# Altium project MB1115.PrjPCB
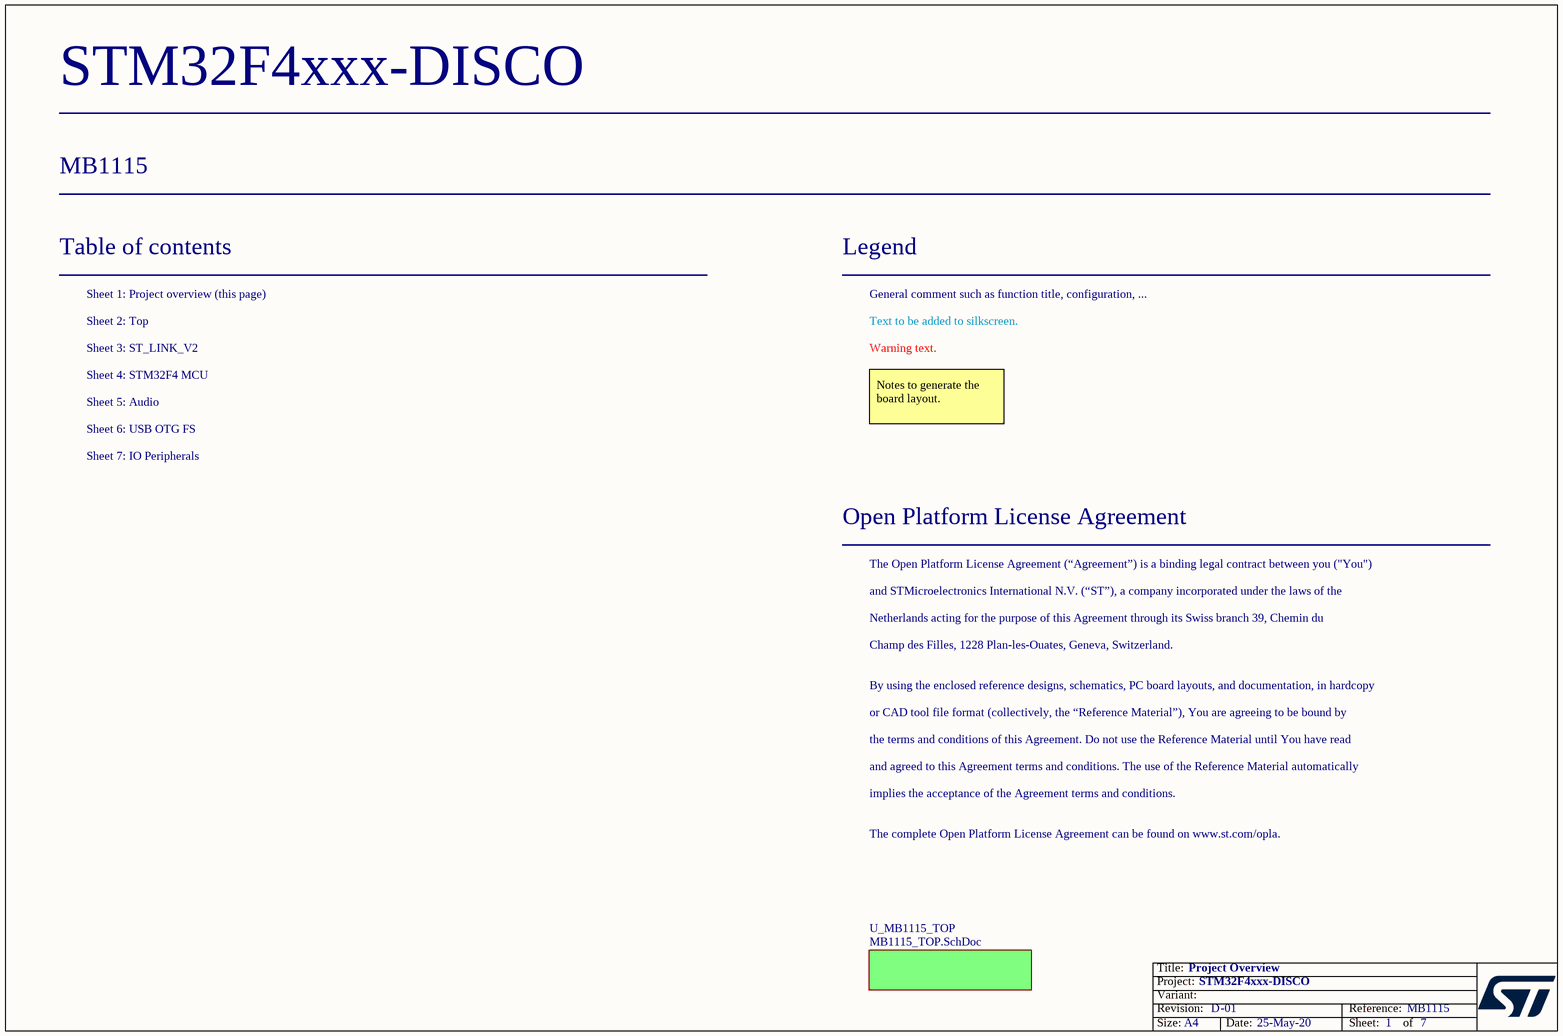
[diagram p0: Project_Overview.SchDoc]
Board_Reference: MB1115; Board_PCB_Revision: D; Board_Name: STM32F4xxx-DISCO; Board_Document_Date: 25-May-20; Board_Assembly_Revision: 01
6 sheets, 156 parts. Net scope: flat (ports and power ports of the same name join across sheets).
Board file: MB1115D.PcbDoc
Sheets:
  Project_Overview.SchDoc
    U_MB1115_TOP = MB1115_TOP.SchDoc
      U_ST_LINK = ST_LINK_V2.SCHDOC
      U_Audio = Audio.SchDoc
      U_IO Peripherals = IO Peripherals.SchDoc
      U_USB_OTG_FS = USB_OTG_FS.SchDoc

## Sheet Project_Overview.SchDoc: Project Overview
size A4; Date: Not used; ApprovedBy: Not used; CheckedBy: Not used; Author: Not used; CompanyName: STMicroelectronics; DrawnBy: Not used; Engineer: Not used; Organization: Not used; Address1: Not used; Address2: Not used; Address3: Not used; Address4: Not used; DocumentNumber: Not used; Revision: Not used; SheetNumber: 1; SheetTotal: 7; CurrentTime: Not used; CurrentDate: Not used; Time: Not used; DocumentFullPathAndName: Not used; DocumentName: Not used; ModifiedDate: Not used; ImagePath: Not used; ProjectName: Not used; Application_BuildNumber: Not used

### Sub-sheets
U_MB1115_TOP = MB1115_TOP.SchDoc: no entries

### Notes on the sheet
- Table of contents
- Sheet 1: Project overview (this page)
- Legend
- General comment such as function title, configuration, ...
- Sheet 2: Top
- Sheet 3: ST_LINK_V2
- Sheet 4: STM32F4 MCU
- Text to be added to silkscreen.
- Warning text.
- Sheet 6: USB OTG FS
- Sheet 5: Audio
- Notes to generate the board layout.
- Sheet 7: IO Peripherals
- Open Platform License Agreement
- The Open Platform License Agreement (“Agreement”) is a binding legal contract between you ("You")
- and STMicroelectronics International N.V. (“ST”), a company incorporated under the laws of the
- Netherlands acting for the purpose of this Agreement through its Swiss branch 39, Chemin du
- Champ des Filles, 1228 Plan-les-Ouates, Geneva, Switzerland.
- By using the enclosed reference designs, schematics, PC board layouts, and documentation, in hardcopy
- or CAD tool file format (collectively, the “Reference Material”), You are agreeing to be bound by
- the terms and conditions of this Agreement. Do not use the Reference Material until You have read
- and agreed to this Agreement terms and conditions. The use of the Reference Material automatically
- implies the acceptance of the Agreement terms and conditions.
- The complete Open Platform License Agreement can be found on www.st.com/opla.
- Title:
- Project:
- Size:
- Revision:
- Variant:
- A4
- -
- Date:
- Reference:
- Sheet:
- of

## Sheet MB1115_TOP.SchDoc: TOP
size A4; DocumentNumber: 1; SheetNumber: 2; SheetTotal: 7; PageSetup: Record=PageOptions|CenterHorizontal=True|CenterVertical=True|PrintScale=1.00|XCorrection=1.00|YCorrection=1.00|PrintKind=1|BorderSize=5000000|LeftOffset=0|BottomOffset=0|Orientation=2|PaperLength=1000|PaperWidth=1000|Scale=100|PaperSource=15|PrintQuality=1200|MediaType=1|DitherType=10|PaperKind=A4|PrintScaleMode=1
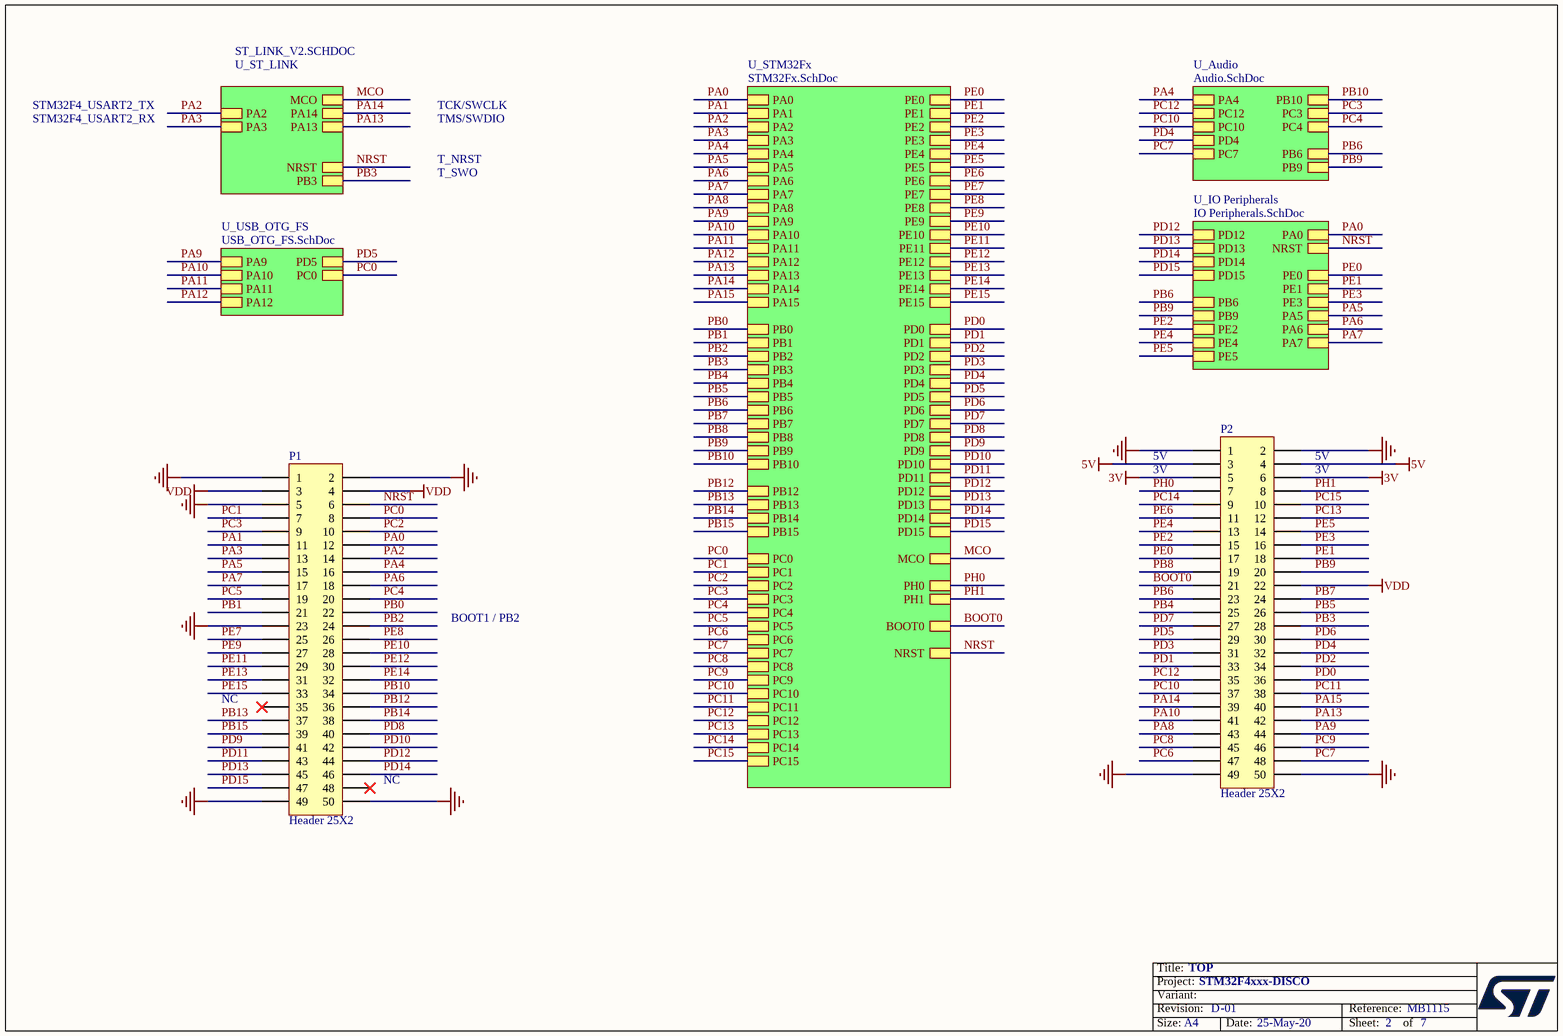
[diagram p1: MB1115_TOP.SchDoc]

### Parts
P1  Header 25X2  [HDR2X25 (Primary)]
P2  Header 25X2  [HDR2X25 (Primary)]

### Sub-sheets
U_Audio = Audio.SchDoc: PA4, PC12, PC10, PD4, PC7, PC3, PB10, PC4, PB6, PB9
U_IO Peripherals = IO Peripherals.SchDoc: PA0, NRST, PE0, PE1, PE3, PA5, PA7, PA6, PE4, PE5, PE2, PB6, PB9, PD12, PD13, PD14, PD15
U_ST_LINK = ST_LINK_V2.SCHDOC: PA13, PA14, NRST, PB3, MCO, PA3, PA2
U_STM32Fx = STM32Fx.SchDoc (file not in this document): PD2, BOOT0, PH1, PH0, NRST, PE0, PE1, PE2, PE3, PE4, PE5, PE6, PE7, PE8, PE9, PE10, PE11, PE12, PE13, PE14, PE15, PD0, PD1, PD3, PD4, PD5, PD6, PD7, PD8, PD9, PD10, PD11, PD12, PD13, PD14, PD15, MCO, PA1, PA2, PA3, PA4, PA5, PA6, PA7, PA8, PA9, PA10, PA11, PA12, PA13, PA14, PA15, PB1, PB2, PB3, PB4, PB5, PB6, PB7, PB8, PB9, PB10, PB12, PB13, PB14, PB15, PC1, PC2, PC3, PC4, PC5, PC6, PC7, PC8, PC9, PC10, PC11, PC12, PC13, PA0, PB0, PC0, PC14, PC15
U_USB_OTG_FS = USB_OTG_FS.SchDoc: PC0, PD5, PA9, PA10, PA11, PA12

### Nets
3V: P2.5 P2.6
5V: P2.3 P2.4
GND: P1.1 P1.2 P1.5 P1.23 P1.49 P1.50 P2.1 P2.2 P2.49 P2.50
VDD: P1.3 P1.4 P2.22
BOOT0: P2.21 ; sheet U_STM32Fx/BOOT0
MCO: sheet U_ST_LINK/MCO, sheet U_STM32Fx/MCO
NRST: P1.6 ; sheet U_ST_LINK/NRST, sheet U_IO Peripherals/NRST, sheet U_STM32Fx/NRST
PA0: P1.12 ; sheet U_IO Peripherals/PA0, sheet U_STM32Fx/PA0
PA1: P1.11 ; sheet U_STM32Fx/PA1
PA2: P1.14 ; sheet U_ST_LINK/PA2, sheet U_STM32Fx/PA2
PA3: P1.13 ; sheet U_ST_LINK/PA3, sheet U_STM32Fx/PA3
PA4: P1.16 ; sheet U_Audio/PA4, sheet U_STM32Fx/PA4
PA5: P1.15 ; sheet U_IO Peripherals/PA5, sheet U_STM32Fx/PA5
PA6: P1.18 ; sheet U_IO Peripherals/PA6, sheet U_STM32Fx/PA6
PA7: P1.17 ; sheet U_IO Peripherals/PA7, sheet U_STM32Fx/PA7
PA8: P2.43 ; sheet U_STM32Fx/PA8
PA9: P2.44 ; sheet U_STM32Fx/PA9, sheet U_USB_OTG_FS/PA9
PA10: P2.41 ; sheet U_STM32Fx/PA10, sheet U_USB_OTG_FS/PA10
PA11: sheet U_STM32Fx/PA11, sheet U_USB_OTG_FS/PA11
PA12: sheet U_STM32Fx/PA12, sheet U_USB_OTG_FS/PA12
PA13: P2.42 ; sheet U_ST_LINK/PA13, sheet U_STM32Fx/PA13
PA14: P2.39 ; sheet U_ST_LINK/PA14, sheet U_STM32Fx/PA14
PA15: P2.40 ; sheet U_STM32Fx/PA15
PB0: P1.22 ; sheet U_STM32Fx/PB0
PB1: P1.21 ; sheet U_STM32Fx/PB1
PB2: P1.24 ; sheet U_STM32Fx/PB2
PB3: P2.28 ; sheet U_ST_LINK/PB3, sheet U_STM32Fx/PB3
PB4: P2.25 ; sheet U_STM32Fx/PB4
PB5: P2.26 ; sheet U_STM32Fx/PB5
PB6: P2.23 ; sheet U_Audio/PB6, sheet U_IO Peripherals/PB6, sheet U_STM32Fx/PB6
PB7: P2.24 ; sheet U_STM32Fx/PB7
PB8: P2.19 ; sheet U_STM32Fx/PB8
PB9: P2.20 ; sheet U_Audio/PB9, sheet U_IO Peripherals/PB9, sheet U_STM32Fx/PB9
PB10: P1.34 ; sheet U_Audio/PB10, sheet U_STM32Fx/PB10
PB12: P1.36 ; sheet U_STM32Fx/PB12
PB13: P1.37 ; sheet U_STM32Fx/PB13
PB14: P1.38 ; sheet U_STM32Fx/PB14
PB15: P1.39 ; sheet U_STM32Fx/PB15
PC0: P1.8 ; sheet U_STM32Fx/PC0, sheet U_USB_OTG_FS/PC0
PC1: P1.7 ; sheet U_STM32Fx/PC1
PC2: P1.10 ; sheet U_STM32Fx/PC2
PC3: P1.9 ; sheet U_Audio/PC3, sheet U_STM32Fx/PC3
PC4: P1.20 ; sheet U_Audio/PC4, sheet U_STM32Fx/PC4
PC5: P1.19 ; sheet U_STM32Fx/PC5
PC6: P2.47 ; sheet U_STM32Fx/PC6
PC7: P2.48 ; sheet U_Audio/PC7, sheet U_STM32Fx/PC7
PC8: P2.45 ; sheet U_STM32Fx/PC8
PC9: P2.46 ; sheet U_STM32Fx/PC9
PC10: P2.37 ; sheet U_Audio/PC10, sheet U_STM32Fx/PC10
PC11: P2.38 ; sheet U_STM32Fx/PC11
PC12: P2.35 ; sheet U_Audio/PC12, sheet U_STM32Fx/PC12
PC13: P2.12 ; sheet U_STM32Fx/PC13
PC14: P2.9 ; sheet U_STM32Fx/PC14
PC15: P2.10 ; sheet U_STM32Fx/PC15
PD0: P2.36 ; sheet U_STM32Fx/PD0
PD1: P2.33 ; sheet U_STM32Fx/PD1
PD2: P2.34 ; sheet U_STM32Fx/PD2
PD3: P2.31 ; sheet U_STM32Fx/PD3
PD4: P2.32 ; sheet U_Audio/PD4, sheet U_STM32Fx/PD4
PD5: P2.29 ; sheet U_STM32Fx/PD5, sheet U_USB_OTG_FS/PD5
PD6: P2.30 ; sheet U_STM32Fx/PD6
PD7: P2.27 ; sheet U_STM32Fx/PD7
PD8: P1.40 ; sheet U_STM32Fx/PD8
PD9: P1.41 ; sheet U_STM32Fx/PD9
PD10: P1.42 ; sheet U_STM32Fx/PD10
PD11: P1.43 ; sheet U_STM32Fx/PD11
PD12: P1.44 ; sheet U_IO Peripherals/PD12, sheet U_STM32Fx/PD12
PD13: P1.45 ; sheet U_IO Peripherals/PD13, sheet U_STM32Fx/PD13
PD14: P1.46 ; sheet U_IO Peripherals/PD14, sheet U_STM32Fx/PD14
PD15: P1.47 ; sheet U_IO Peripherals/PD15, sheet U_STM32Fx/PD15
PE0: P2.17 ; sheet U_IO Peripherals/PE0, sheet U_STM32Fx/PE0
PE1: P2.18 ; sheet U_IO Peripherals/PE1, sheet U_STM32Fx/PE1
PE2: P2.15 ; sheet U_IO Peripherals/PE2, sheet U_STM32Fx/PE2
PE3: P2.16 ; sheet U_IO Peripherals/PE3, sheet U_STM32Fx/PE3
PE4: P2.13 ; sheet U_IO Peripherals/PE4, sheet U_STM32Fx/PE4
PE5: P2.14 ; sheet U_IO Peripherals/PE5, sheet U_STM32Fx/PE5
PE6: P2.11 ; sheet U_STM32Fx/PE6
PE7: P1.25 ; sheet U_STM32Fx/PE7
PE8: P1.26 ; sheet U_STM32Fx/PE8
PE9: P1.27 ; sheet U_STM32Fx/PE9
PE10: P1.28 ; sheet U_STM32Fx/PE10
PE11: P1.29 ; sheet U_STM32Fx/PE11
PE12: P1.30 ; sheet U_STM32Fx/PE12
PE13: P1.31 ; sheet U_STM32Fx/PE13
PE14: P1.32 ; sheet U_STM32Fx/PE14
PE15: P1.33 ; sheet U_STM32Fx/PE15
PH0: P2.7 ; sheet U_STM32Fx/PH0
PH1: P2.8 ; sheet U_STM32Fx/PH1

Not connected (* = marked no-connect by the designer): P1 35* 48*

### Notes on the sheet
- STM32F4_USART2_TX
- TCK/SWCLK
- STM32F4_USART2_RX
- TMS/SWDIO
- T_SWO
- T_NRST
- 5V
- 3V
- (near P2) 5V
- (near P2) 3V
- BOOT1 / PB2
- NC
- (near P1) NC
- Title:
- Project:
- Size:
- Revision:
- Variant:
- A4
- -
- Date:
- Reference:
- Sheet:
- of

### Library data of the parts
P1 P2 = Header 25X2: Header, 25-Pin, Dual row; LatestRevisionDate: 17-Jul-2002; LatestRevisionNote: Re-released for DXP Platform.; Publisher: Altium Limited

## Sheet ST_LINK_V2.SCHDOC: ST-LINK/V2 (SWD only)
size A4; DocumentNumber: 2; SheetNumber: 3; SheetTotal: 7
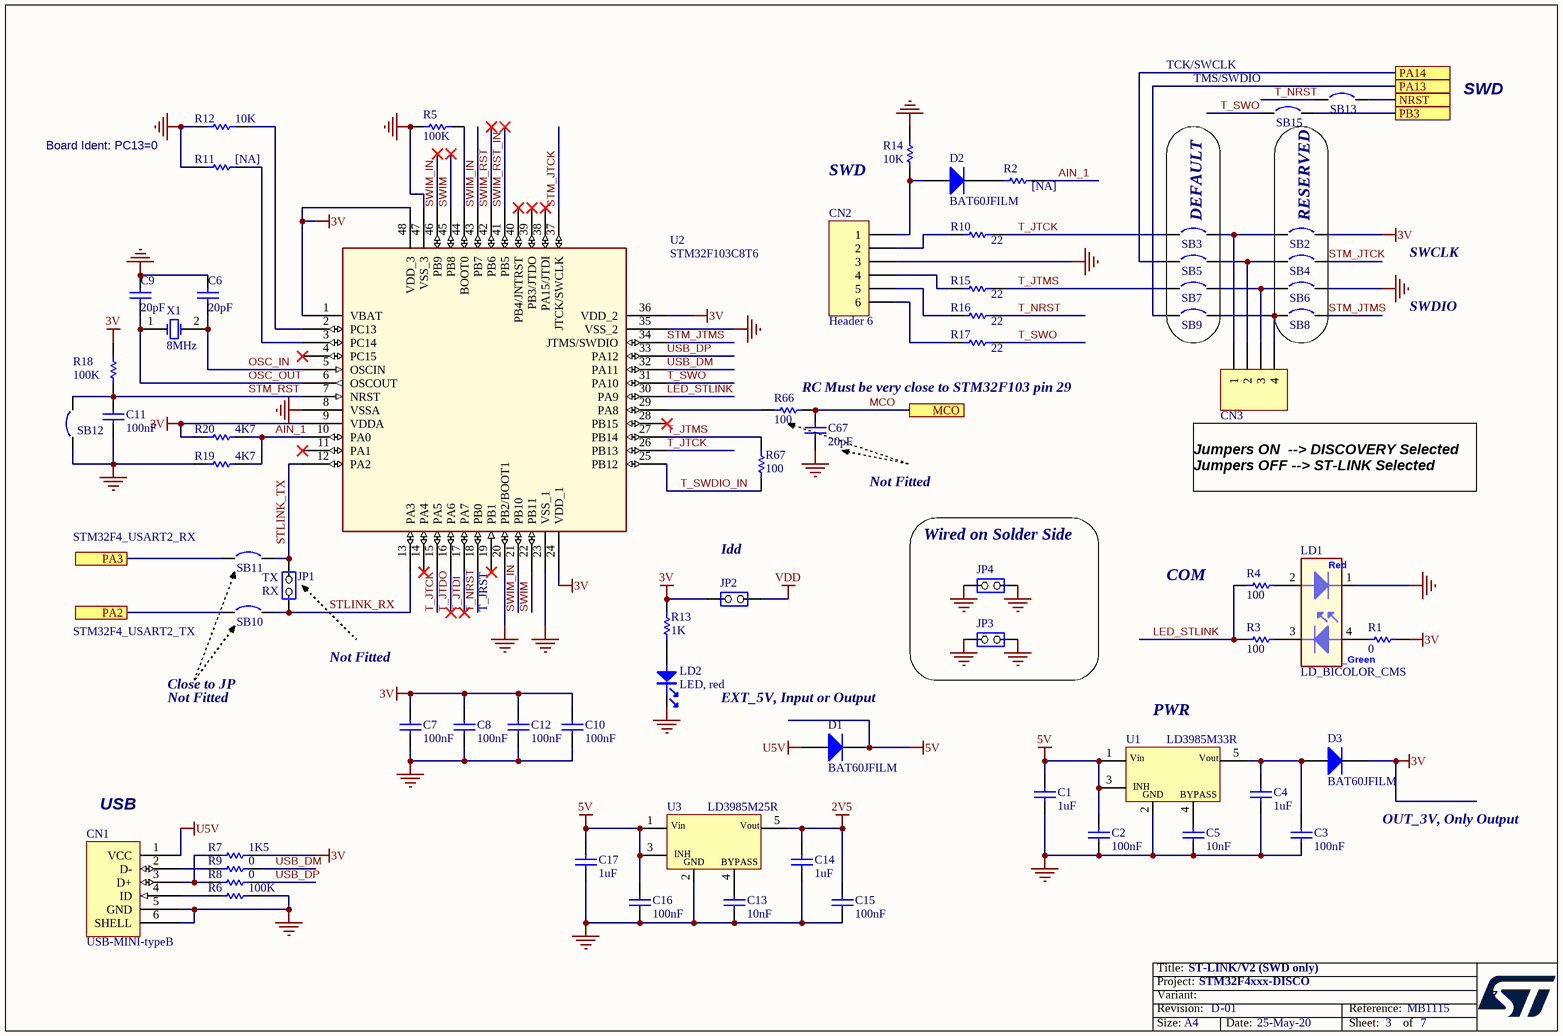
[diagram p2: ST_LINK_V2.SCHDOC]

### Parts
C1  1uF  [0603C (Primary)]
C2  100nF  [0402C (Primary)]
C3  100nF  [0402C (Primary)]
C4  1uF  [0603C (Primary)]
C5  10nF  [0603C (Primary)]
C6  20pF  [0402C (Primary)]
C7  100nF  [0402C (Primary)]
C8  100nF  [0402C (Primary)]
C9  20pF  [0402C (Primary)]
C10  100nF  [0402C (Primary)]
C11  100nF  [0402C (Primary)]
C12  100nF  [0402C (Primary)]
C13  10nF  [0603C (Primary)]
C14  1uF  [0603C (Primary)]
C15  100nF  [0402C (Primary)]
C16  100nF  [0402C (Primary)]
C17  1uF  [0603C (Primary)]
C67  20pF  [0402C (Primary)]
CN1  USB-MINI-typeB  [USB-MINI-B-SMD (Primary)]
CN2  Header 6  [HDR1X6 (Primary)]
CN3  Header 4  [Header 4 (Primary)]  (value not drawn)
D1  BAT60JFILM  [SOD323/A (Primary)]
D2  BAT60JFILM  [SOD323/A (Primary)]
D3  BAT60JFILM  [SOD323/A (Primary)]
JP1  JP2  [SIP2/2.54 (Primary)]  (value not drawn)
JP2  (no value)  [SIP2/2.54 (Primary)]
JP3  (no value)  [SIP2/2.54 (Primary)]
JP4  (no value)  [SIP2/2.54 (Primary)]
LD1  LD_BICOLOR_CMS  [HSMF-A201 (Primary)]
LD2  LED, red  [0603D (Primary)]
R1  0  [0402R (Primary)]
R2  [NA]  [0402R (Primary)]
R3  100  [0402R (Primary)]
R4  100  [0402R (Primary)]
R5  100K  [0402R (Primary)]
R6  100K  [0402R (Primary)]
R7  1K5  [0402R (Primary)]
R8  0  [0402R (Primary)]
R9  0  [0402R (Primary)]
R10  22  [0402R (Primary)]
R11  [NA]  [0402R (Primary)]
R12  10K  [0402R (Primary)]
R13  1K  [0402R (Primary)]
R14  10K  [0402R (Primary)]
R15  22  [0402R (Primary)]
R16  22  [0402R (Primary)]
R17  22  [0402R (Primary)]
R18  100K  [0402R (Primary)]
R19  4K7  [0402R (Primary)]
R20  4K7  [0402R (Primary)]
R66  100  [0402R (Primary)]
R67  100  [0402R (Primary)]
SB2  Circuit Breaker  [JP2_SMD (Primary)]  (value not drawn)
SB3  Circuit Breaker  [JP2_SMD (Primary)]  (value not drawn)
SB4  Circuit Breaker  [JP2_SMD (Primary)]  (value not drawn)
SB5  Circuit Breaker  [JP2_SMD (Primary)]  (value not drawn)
SB6  Circuit Breaker  [JP2_SMD (Primary)]  (value not drawn)
SB7  Circuit Breaker  [JP2_SMD (Primary)]  (value not drawn)
SB8  Circuit Breaker  [JP2_SMD (Primary)]  (value not drawn)
SB9  Circuit Breaker  [JP2_SMD (Primary)]  (value not drawn)
SB10  Circuit Breaker  [JP2_SMD (Primary)]  (value not drawn)
SB11  Circuit Breaker  [JP2_SMD (Primary)]  (value not drawn)
SB12  Circuit Breaker  [JP2_SMD (Primary)]  (value not drawn)
SB13  Circuit Breaker  [JP2_SMD (Primary)]  (value not drawn)
SB15  Circuit Breaker  [JP2_SMD (Primary)]  (value not drawn)
U1  LD3985M33R  [SOT-23-5L (Primary)]
U2  STM32F103C8T6  [LQFP48 (Primary)]
U3  LD3985M25R  [SOT-23-5L (Primary)]
X1  8MHz  [XTAL1 (Primary)]

### Blocks framed on the sheet
DEFAULT: SB3 SB5 SB7 SB9
RESERVED: SB2 SB4 SB6 SB8
Wired on Solder Side: JP3 JP4

### Ports
MCO, NRST, PA2, PA3, PA13, PA14, PB3

### Nets
2V5: C14.1 C15.2 U3.5(Vout)
3V: C7.2 C8.2 C10.2 C12.1 D3.2(K) JP2.1(COMMON) R1.2 R7.2 R13.2 R18.2 R20.1 SB2.2 U2.1(VBAT) U2.9(VDDA) U2.24(VDD_1) U2.36(VDD_2) U2.48(VDD_3)
5V: C1.2 C2.2 C16.2 C17.2 D1.2(K) U1.1(Vin) U1.3(CE) U3.1(Vin) U3.3(CE)
GND: C1.1 C2.1 C3.1 C4.2 C5.1 C6.1 C7.1 C8.1 C9.1 C10.1 C11.1 C12.2 C13.1 C14.2 C15.1 C16.1 C17.1 C67.2 CN1.5(GND) CN1.6(SHELL) CN2.3 JP3.1(COMMON) JP3.2(NO) JP4.1(COMMON) JP4.2(NO) LD1.1 LD2.2 R5.1 R6.2 R11.1 R12.1 R14.2 R19.1 SB6.2 SB12.1 U1.2(GND) U2.8(VSSA) U2.20(PB2/BOOT1) U2.23(VSS_1) U2.35(VSS_2) U2.47(VSS_3) U3.2(GND)
U5V: CN1.1(VCC) D1.1(A)
VDD: JP2.2(NO)
AIN_1: R2.2 R19.2 R20.2 U2.10(PA0)
LED_STLINK: R3.1 R4.1 U2.30(PA9)
MCO: C67.1 R66.2 ; port MCO
NRST: SB13.2 ; port NRST
OSC_IN: C6.2 U2.5(OSCIN) X1.2(OSC2)
OSC_OUT: C9.2 U2.6(OSCOUT) X1.1(OSC1)
STLINK_RX: JP1.1(COMMON) SB10.2 U2.13(PA3)
STLINK_TX: JP1.2(NO) SB11.2 U2.12(PA2)
STM_JTCK: SB4.2 U2.37(JTCK/SWCLK)
STM_JTMS: SB8.2 U2.34(JTMS/SWDIO)
STM_RST: C11.2 R18.1 SB12.2 U2.7(NRST)
SWIM: U2.22(PB11) U2.45(PB8)
SWIM_IN: U2.21(PB10) U2.43(PB7) U2.46(PB9)
SWIM_RST: U2.42(PB6)
SWIM_RST_IN: U2.41(PB5)
T_JTCK: R10.2 SB3.1 U2.15(PA5) U2.26(PB13)
T_JTDI: U2.17(PA7)
T_JTDO: U2.16(PA6)
T_JTMS: R15.2 R67.2 SB7.1 U2.27(PB14)
T_NRST: R16.2 SB13.1 U2.18(PB0)
T_SWDIO_IN: R67.1 U2.25(PB12)
T_SWO: R17.2 SB15.1 U2.31(PA10)
USB_DM: R9.2 U2.32(PA11)
USB_DP: R8.2 U2.33(PA12)
NetC3_2: C3.2 C4.1 D3.1(A) U1.5(Vout)
NetC5_2: C5.2 U1.4(BYPASS)
NetC13_2: C13.2 U3.4(BYPASS)
NetCN1_2: CN1.2(D-) R9.1
NetCN1_3: CN1.3(D+) R7.1 R8.1
NetCN1_4: CN1.4(ID) R6.1
NetCN2_1: CN2.1 D2.1(A) R14.1
NetCN2_2: CN2.2 R10.1
NetCN2_4: CN2.4 R15.1
NetCN2_5: CN2.5 R16.1
NetCN2_6: CN2.6 R17.1
NetCN3_1: CN3.1 SB2.1 SB3.2
NetCN3_2: CN3.2 SB4.1 SB5.2
NetCN3_3: CN3.3 SB6.1 SB7.2
NetCN3_4: CN3.4 SB8.1 SB9.2
NetD2_2: D2.2(K) R2.1
NetLD1_2: LD1.2 R4.2
NetLD1_3: LD1.3 R3.2
NetLD1_4: LD1.4 R1.1
NetLD2_1: LD2.1 R13.1
NetR5_2: R5.2 U2.44(BOOT0)
NetR11_2: R11.2 U2.3(PC14)
NetR12_2: R12.2 U2.2(PC13)
NetR66_1: R66.1 U2.29(PA8)
NetSB5_1: SB5.1 ; port PA14
NetSB9_1: SB9.1 ; port PA13
NetSB10_1: SB10.1 ; port PA2
NetSB11_1: SB11.1 ; port PA3
NetSB15_2: SB15.2 ; port PB3

Not connected (* = marked no-connect by the designer): U2 4(PC15)* 11(PA1)* 14(PA4)* 19(PB1)* 28(PB15)* 38(PA15/JTDI)* 39(PB3/JTDO)* 40(PB4/JNTRST)*

### Notes on the sheet
- TCK/SWCLK
- (near SB15) TMS/SWDIO
- SWD
- Board Ident: PC13=0
- SWCLK
- SWDIO
- (near R66) RC Must be very close to STM32F103 pin 29
- Not Fitted
- Jumpers ON  --> DISCOVERY Selected
  Jumpers OFF --> ST-LINK Selected
- STM32F4_USART2_RX
- TX
- (near JP2) Idd
- COM
- STM32F4_USART2_TX
- RX
- (near U2) T_JRST
- Close to JP
- EXT_5V, Input or Output
- (near U1) PWR
- (near CN1) USB
- OUT_3V, Only Output
- Title:
- Project:
- Size:
- Revision:
- Variant:
- A4
- -
- Date:
- Reference:
- Sheet:
- of
- (in symbol LD3985M25R) INH
- (in symbol LD3985M33R) INH
- (in symbol LD_BICOLOR_CMS) Red; _Green

### Library data of the parts
C1 C4 C14 C17 = Cap_1uF_X5R_10%_0603: Capacitor,1uF,16V,X5R,10%,0603,YAGEO; Manuf_Part_1: CC0603KRX5R7BB105; Revision: July-2002: Re-released for DXP Platform.; Value: 1uF; Order: CC0603KRX5R7BB105; Manuf_1: YAGEO
C2 C3 C7 C8 C10-C12 C15 C16 = Cap_100nF_X7R_10%_0402: Capacitor,100nF,16V,X7R,10%,0402,YAGEO; Manuf_Part_1: CC0402KRX7R7BB104; Revision: July-2002: Re-released for DXP Platform.; Value: 100nF; Order: CC0402KRX7R7BB104; Manuf_1: YAGEO
C5 C13 = Cap_10nF_X7R_10%_0603: Capacitor,10nF,50V,X7R,10%,0603,YAGEO; Manuf_Part_1: CC0603KRX7R9BB103; Revision: July-2002: Re-released for DXP Platform.; Value: 10nF; Order: CC0603KRX7R9BB103; Manuf_1: YAGEO
C6 C9 = Cap_20pF_NPO_5%_0402: Capacitor,20pF,50V,NPO,5%,0402,YAGEO; Order: CC0402JRNPO9BN200; Revision: July-2002: Re-released for DXP Platform.; Value: 20pF; Manuf_1: YAGEO; Manuf_Part_1: CC0402JRNPO9BN200
C67 = Cap_20pF_NPO_5%_0402: Capacitor,20pF,50V,NPO,5%,0402,YAGEO; Order: CC0402JRNPO9BN200; Fitted: NO; Revision: July-2002: Re-released for DXP Platform.; Value: 20pF; Manuf_1: YAGEO; Manuf_Part_1: CC0402JRNPO9BN200
CN1 = USB-MINI-typeB connector: Manuf_Part_1: 5075BMR-05-SM; Manuf_Part_2: 218205M1110T; Manuf_2: lyconn; Order: 5075BMR-05-SM
CN2 = Header 6: Header, 6-Pin; LatestRevisionDate: 17-Jul-2002; LatestRevisionNote: Re-released for DXP Platform.; Publisher: Altium Limited
CN3 = Header 4: Header, 4-Pin; Revision: 17-Jul-2002: Re-released for DXP Platform.; Publisher: Altium Limited
D1-D3 = BAT60JFILM: Manuf_1: STM; Provided: ST; ECCN_US/EU: EAR99/NEC; Ref St: 9151097; Revision: July-2002: Re-released for DXP Platform.; Order: BAT60JFILM; Manuf_Part_1: BAT60JFILM; Distrib: ST
JP1 = JP2: Fitted: NO
JP2-JP4 = JP2
LD1 = LD_BICOLOR_CMS: Bicolor Led; Manuf_Part_1: HSMF-A201-A00J1; Manuf_1: Avago Technologies; Manuf_2: everluck; Manuf_Part_2: LE-RGW35280; Ref St: xxxxxx; Distrib: RADIOSPARES; Footprint: HSMF-A201
LD2 = LED_red: LED, red, 0603; Manuf_1: everlight; Manuf_Part_1: 19-213-R6C-AP1Q2B/3T; Order: 19-213-R6C-AP1Q2B/3T
R1 R8 R9 = Res_0_0402: Resistor,0,0402; Value: 0
R2 R11 = Res_NA_0402: Resistor,[NA],0402; Fitted: NO; Value: [NA]
R3-R7 R10 R12-R20 R67 = res1: Resistor; Published: 8-Jun-2000; Revision: July-2002: Re-released for DXP Platform.; Publisher: Altium Limited
  R3 R4 R67: Value: 100
  R5 R6 R18: Value: 100K
  R7: Value: 1K5
  R10 R15-R17: Value: 22
  R12 R14: Value: 10K
  R13: Value: 1K
  R19 R20: Value: 4K7
R66 = res1: Resistor; Fitted: NO; Published: 8-Jun-2000; Revision: July-2002: Re-released for DXP Platform.; Publisher: Altium Limited; Value: 100
SB2 SB4 SB6 SB8 SB10-SB12 = Circuit Breaker: Solder: NO; Revision: July-2002: Re-released for DXP Platform.
SB3 SB5 SB7 SB9 SB13 SB15 = Circuit Breaker: Solder: YES; Revision: July-2002: Re-released for DXP Platform.
U1 = LD3985M33R: Ultra low drop-low noise BiCMOS voltage, regulators low ESR capacitors compatible; Manuf_1: STM; Provided: ST; Ref St: 9176161; ECCN_US/EU: EAR99/NEC; Manuf_Part_1: LD3985M33R; Distrib: ST; Order: LD3985M33R
U2 = STM32F103C8T6: Medium-density performance line ARM-based 32-bit MCU with 64KB Flash; Manuf_1: STM; Ref St: 9175981; Provided: ST; ECCN_US/EU: 3A991A2/NEC; Footprint: QFP48 7X7; Manuf_Part_1: STM32F103C8T6; Distrib: ST; Order: STM32F103C8T6
U3 = LD3985M25R: Ultra low drop-low noise BiCMOS voltage, regulators low ESR capacitors compatible; Manuf_1: STM; Provided: ST; Ref St: 9176007; ECCN_US/EU: EAR99/NEC; Manuf_Part_1: LD3985M25R; Order: LD3985M25R; Distrib: ST
X1 = XTAL_8MHZ_20PPM: Crystal Oscillator,8Mhz,20PF,20PPM,-10-70 degree,DIP,HC-49S; Manuf_Part_1: HC-49S-C20QSA-8.000MHZ; Order: HC-49S-C20QSA-8.000MHZ

## Sheet Audio.SchDoc: Audio
size A4; DocumentNumber: 4; SheetNumber: 5; SheetTotal: 7
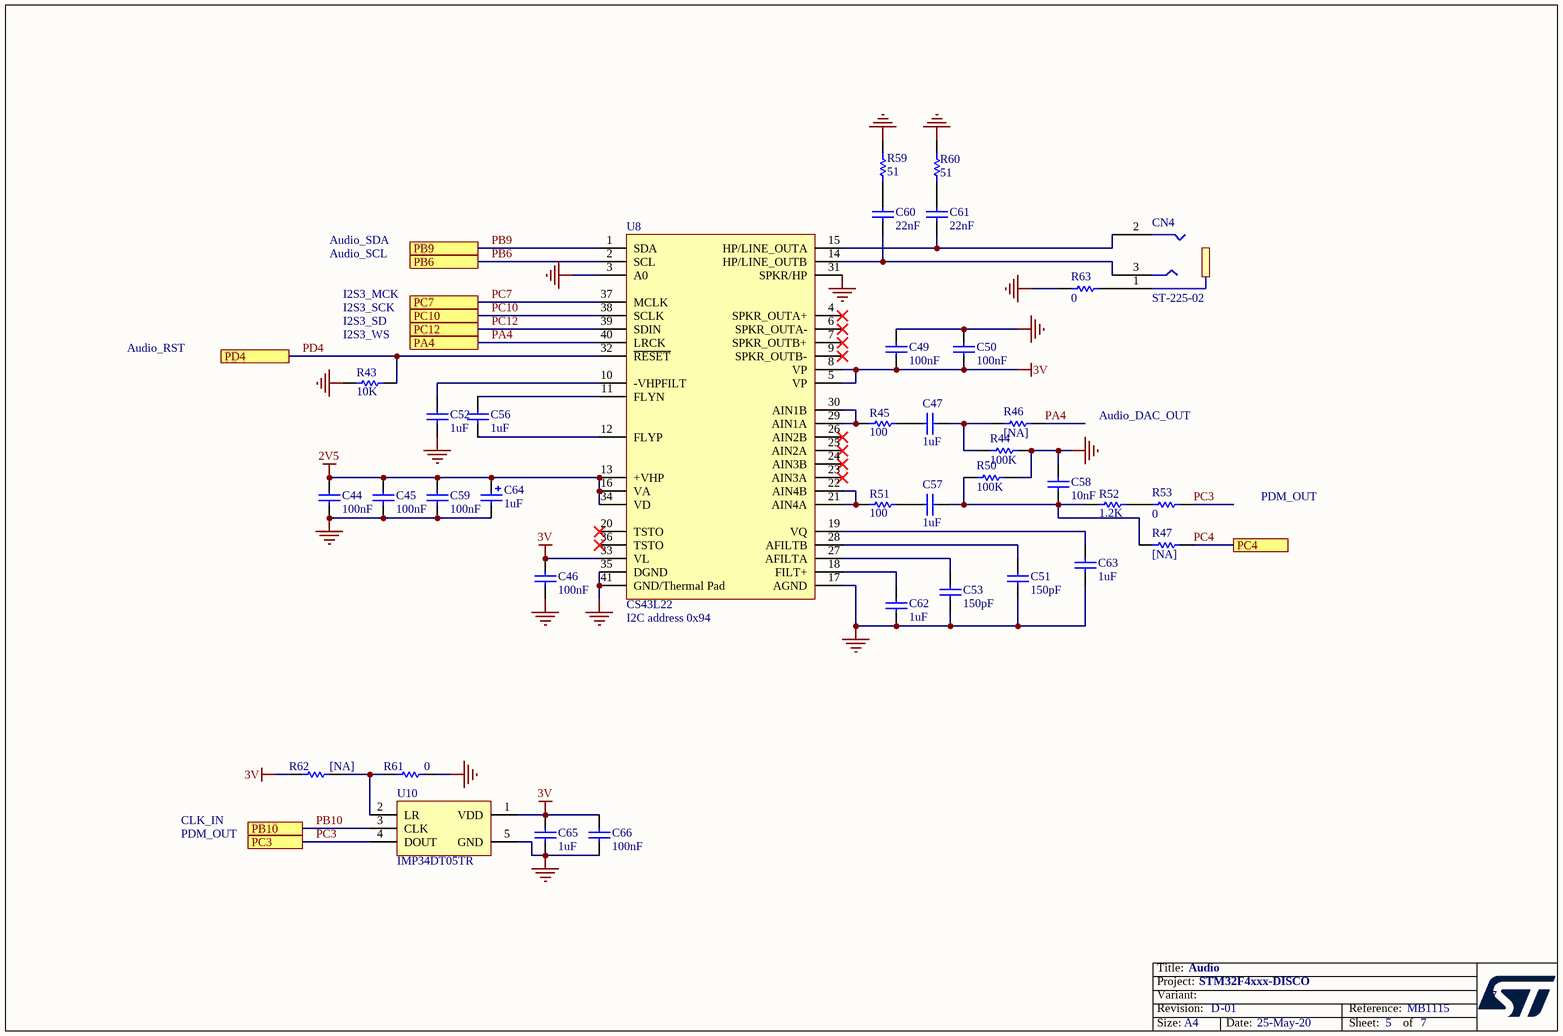
[diagram p3: Audio.SchDoc]

### Parts
C44  100nF  [0402C (Primary)]
C45  100nF  [0402C (Primary)]
C46  100nF  [0402C (Primary)]
C47  1uF  [0603C (Primary)]
C49  100nF  [0402C (Primary)]
C50  100nF  [0402C (Primary)]
C51  150pF  [0603C (Primary)]
C52  1uF  [0603C (Primary)]
C53  150pF  [0603C (Primary)]
C56  1uF  [0603C (Primary)]
C57  1uF  [0603C (Primary)]
C58  10nF  [0603C (Primary)]
C59  100nF  [0402C (Primary)]
C60  22nF  [0603C (Primary)]
C61  22nF  [0603C (Primary)]
C62  1uF  [0603C (Primary)]
C63  1uF  [0603C (Primary)]
C64  1uF  [TAN-A (Primary)]
C65  1uF  [0603C (Primary)]
C66  100nF  [0402C (Primary)]
CN4  ST-225-02  [JACK-ST-225 (Primary)]
R43  10K  [0402R (Primary)]
R44  100K  [0402R (Primary)]
R45  100  [0402R (Primary)]
R46  [NA]  [0402R (Primary)]
R47  [NA]  [0402R (Primary)]
R50  100K  [0402R (Primary)]
R51  100  [0402R (Primary)]
R52  1.2K  [0402R (Primary)]
R53  0  [0402R (Primary)]
R59  51  [0402R (Primary)]
R60  51  [0402R (Primary)]
R61  0  [0402R (Primary)]
R62  [NA]  [0402R (Primary)]
R63  0  [0402R (Primary)]
U8  CS43L22  [QFN40_6X6 (Primary)]
U10  IMP34DT05TR  [MIC_HCLGA_3X4X1_4LD]

### Ports
PA4, PB6, PB9, PB10, PC3, PC4, PC7, PC10, PC12, PD4

### Nets
2V5: C44.2 C45.2 C59.2 C64.1 U8.13(+VHP) U8.16(VA) U8.34(VD)
3V: C46.2 C49.1 C50.2 C65.2 C66.2 R62.2 U8.5(VP) U8.8(VP) U8.33(VL) U10.1(VDD)
GND: C44.1 C45.1 C46.1 C49.2 C50.1 C51.1 C52.2 C53.1 C58.2 C59.1 C62.1 C63.1 C64.2 C65.1 C66.1 R43.2 R44.2 R50.2 R59.2 R60.1 R61.1 R63.1 U8.3(A0) U8.17(AGND) U8.31(SPKR/HP) U8.35(DGND) U8.41(GND/Thermal_Pad) U10.5(GND)
PA4: R46.2 U8.40(LRCK) ; port PA4
PB6: U8.2(SCL) ; port PB6
PB9: U8.1(SDA) ; port PB9
PB10: U10.3(CLK) ; port PB10
PC3: R53.2 U10.4(DOUT) ; port PC3
PC4: R47.2 ; port PC4
PC7: U8.37(MCLK) ; port PC7
PC10: U8.38(SCLK) ; port PC10
PC12: U8.39(SDIN) ; port PC12
PD4: R43.1 U8.32(~{RESET}) ; port PD4
NetC47_1: C47.1 R45.1
NetC47_2: C47.2 R44.1 R46.1
NetC51_2: C51.2 U8.28(AFILTB)
NetC52_1: C52.1 U8.10(-VHPFILT)
NetC53_2: C53.2 U8.27(AFILTA)
NetC56_1: C56.1 U8.12(FLYP)
NetC56_2: C56.2 U8.11(FLYN)
NetC57_1: C57.1 R51.1
NetC57_2: C57.2 C58.1 R47.1 R50.1 R52.1
NetC60_1: C60.1 CN4.3 U8.14(HP/LINE_OUTB)
NetC60_2: C60.2 R59.1
NetC61_1: C61.1 CN4.2 U8.15(HP/LINE_OUTA)
NetC61_2: C61.2 R60.2
NetC62_2: C62.2 U8.18(FILT+)
NetC63_2: C63.2 U8.19(VQ)
NetCN4_1: CN4.1 R63.2
NetR45_2: R45.2 U8.29(AIN1A) U8.30(AIN1B)
NetR51_2: R51.2 U8.21(AIN4A) U8.22(AIN4B)
NetR52_2: R52.2 R53.1
NetR61_2: R61.2 R62.1 U10.2(LR)

Not connected (* = marked no-connect by the designer): U8 4(SPKR_OUTA+)* 6(SPKR_OUTA-)* 7(SPKR_OUTB+)* 9(SPKR_OUTB-)* 20(TSTO)* 23(AIN3A)* 24(AIN3B)* 25(AIN2A)* 26(AIN2B)* 36(TSTO)*

### Notes on the sheet
- Audio_SDA
- Audio_SCL
- I2S3_MCK
- I2S3_SCK
- Audio_RST
- (near R43) I2S3_WS
- I2S3_SD
- Audio_DAC_OUT
- PDM_OUT
- (near U8) I2C address 0x94
- CLK_IN
- Title:
- Project:
- Size:
- Revision:
- Variant:
- A4
- -
- Date:
- Reference:
- Sheet:
- of

### Library data of the parts
C44-C46 C49 C50 C59 C66 = Cap_100nF_X7R_10%_0402: as C2 on sheet ST_LINK_V2; Revision: July-2002: Re-released for DXP Platform.; Value: 100nF; Order: CC0402KRX7R7BB104; Manuf_1: YAGEO
C47 C52 C56 C57 C62 C63 C65 = Cap_1uF_X5R_10%_0603: as C1 on sheet ST_LINK_V2; Revision: July-2002: Re-released for DXP Platform.; Value: 1uF; Order: CC0603KRX5R7BB105; Manuf_1: YAGEO
C51 C53 = Cap_150pF_NPO_5%_0603: Capacitor,150pF,50V,NPO,5%,0603,YAGEO; Order: CC0603JRNPO9BN151; Revision: July-2002: Re-released for DXP Platform.; Value: 150pF; Manuf_1: YAGEO; Manuf_Part_1: CC0603JRNPO9BN151
C58 = Cap_10nF_X7R_10%_0603: as C5 on sheet ST_LINK_V2; Revision: July-2002: Re-released for DXP Platform.; Value: 10nF; Order: CC0603KRX7R9BB103; Manuf_1: YAGEO
C60 C61 = Cap_22nF_X7R_10%_0603: Capacitor,22nF,50V,X7R,10%,0603,YAGEO; Manuf_Part_1: CC0603KRX7R9BB223; Revision: July-2002: Re-released for DXP Platform.; Value: 22nF; Order: CC0603KRX7R9BB223; Manuf_1: YAGEO
C64 = Cap_1uF_POL_10%_TANA: Polarized Capacitor,1uF,16V,10%,typeA,AVX; Manuf_Part_1: TAJA105K016R; Revision: July-2002: Re-released for DXP Platform.; Value: 1uF; Manuf_1: AVX; Distrib: *; Order: TAJA105K016R
CN4 = ST-225-02: Connector Jack 35mm; Manuf_1: XIEJIA Electronics; Order: ST-225-02; Manuf_Part_1: ST-225-02
R43-R45 R50 R51 R59 R60 = res1: Resistor; Value: 1K; Published: 8-Jun-2000; Revision: July-2002: Re-released for DXP Platform.; Publisher: Altium Limited
R46 R47 R62 = Res_NA_0402: Resistor,[NA],0402; Fitted: NO; Value: [NA]
R52 = res1: Resistor; Published: 8-Jun-2000; Revision: July-2002: Re-released for DXP Platform.; Publisher: Altium Limited; Value: 1.2K
R53 R61 R63 = Res_0_0402: Resistor,0,0402; Value: 0
U8 = CS43L22: Low Power, Stereo DAC w/Headphone & Speaker Amps; Manuf_1: Cirrus; Order: CS43L22-CNZ; Manuf_Part_1: CS43L22-CNZ; Distrib: *; ECCN_US/EU: *; Footprint: QFN40
U10 = MCD-01715: MEMS audio sensor omnidirectional digital microphone for industrial applications; Part_Type: IC; Manufacturer: STMICROELECTRONICS; BMS_Part_Number: 9177995; ECCN_US: EAR99; ECCN_EU: NEC; Provided_By: SUBCO with ST control; Internal_Part_Number: MCD-01715; Value: IMP34DT05TR; Status: Released; Manufacturer_Part_Number: IMP34DT05TR; Package: HCLGA-4LD; ComponentLink1Description: Datasheet; ComponentLink1URL: http://tunmcdsvn.tun.st.com/Component_Datasheet_Library/Trunk/IC/STM_Digital-Microphone_IMP34DT05TR

## Sheet IO Peripherals.SchDoc: Peripherals
size A4; DocumentNumber: 6; SheetNumber: 7; SheetTotal: 7
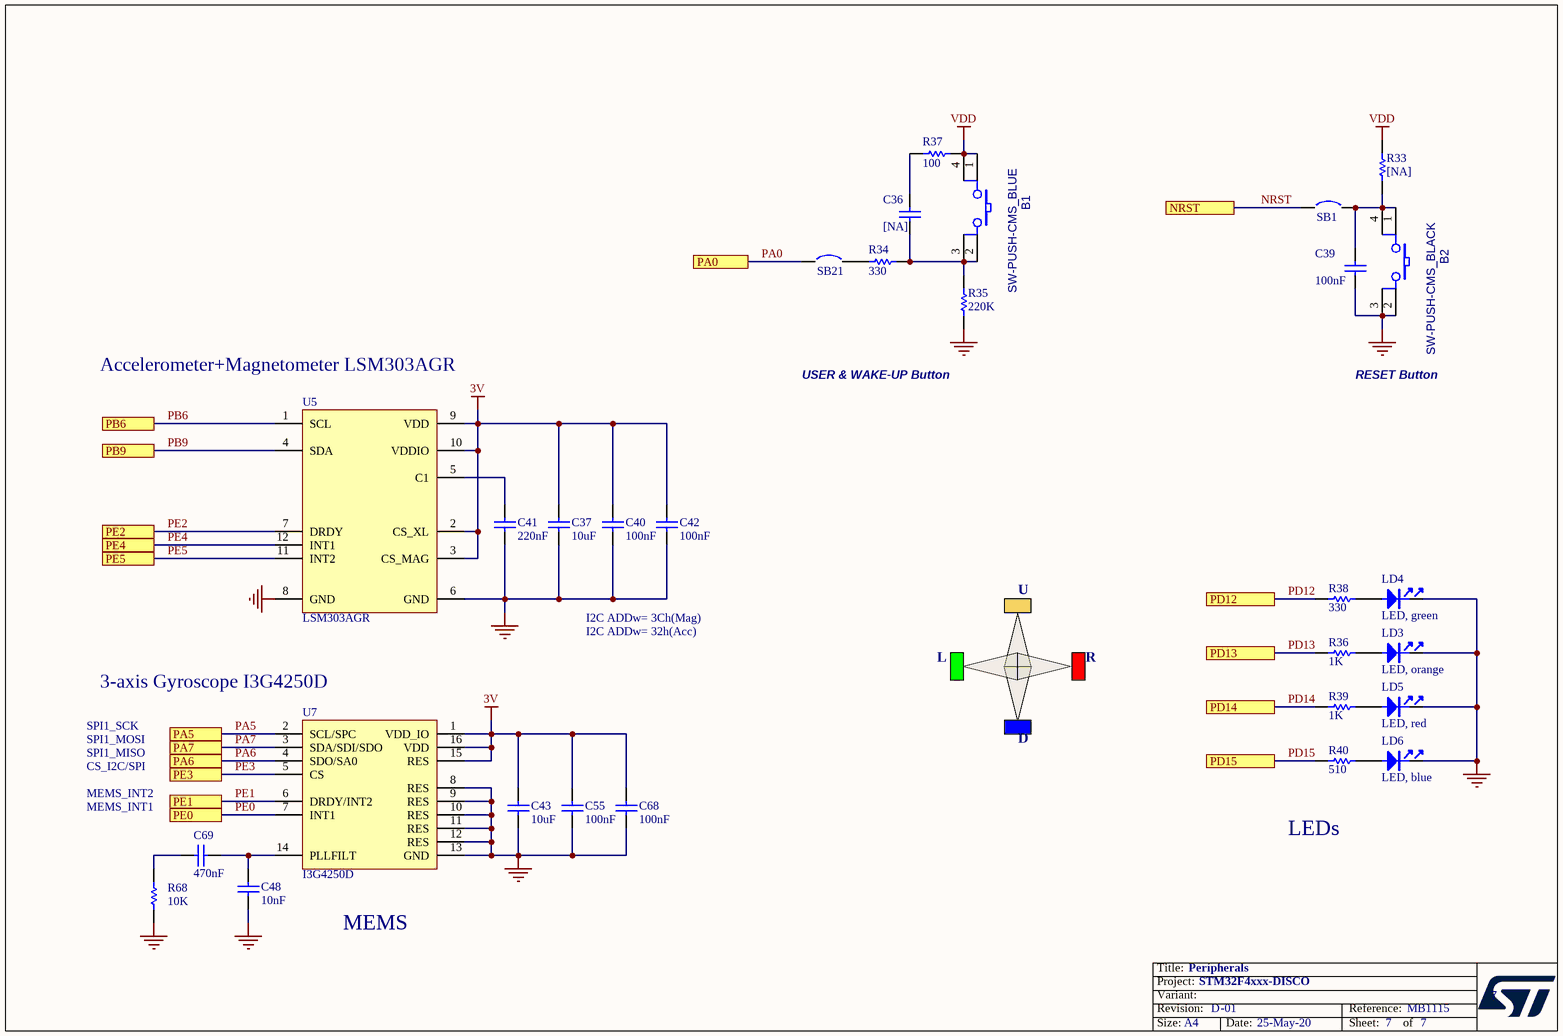
[diagram p4: IO Peripherals.SchDoc]

### Parts
B1  SW-PUSH-CMS_BLUE  [BP1CMS (Primary)]
B2  SW-PUSH-CMS_BLACK  [BP1CMS (Primary)]
C36  [NA]  [0402C (Primary)]
C37  10uF  [0603C (Primary)]
C39  100nF  [0402C (Primary)]
C40  100nF  [0402C (Primary)]
C41  220nF  [0603C (Primary)]
C42  100nF  [0402C (Primary)]
C43  10uF  [0603C (Primary)]
C48  10nF  [0603C (Primary)]
C55  100nF  [0402C (Primary)]
C68  100nF  [0402C (Primary)]
C69  value 470nF  [0603C (Primary)]  (hidden comment: Capacitor)
LD3  LED, orange  [0603D (Primary)]
LD4  LED, green  [0603D (Primary)]
LD5  LED, red  [0603D (Primary)]
LD6  LED, blue  [0603D (Primary)]
R33  [NA]  [0402R (Primary)]
R34  330  [0402R (Primary)]
R35  220K  [0402R (Primary)]
R36  1K  [0402R (Primary)]
R37  100  [0402R (Primary)]
R38  330  [0402R (Primary)]
R39  1K  [0402R (Primary)]
R40  510  [0402R (Primary)]
R68  10K  [0402R (Primary)]
SB1  Circuit Breaker  [JP2_SMD (Primary)]  (value not drawn)
SB21  Circuit Breaker  [JP2_SMD (Primary)]  (value not drawn)
U5  LSM303AGR  [ICC_LGA12_2X2_P050]
U7  I3G4250D  [ICC_LGA16_4X4_P065_H1P1]

### Ports
NRST, PA0, PA5, PA6, PA7, PB6, PB9, PD12, PD13, PD14, PD15, PE0, PE1, PE2, PE3, PE4, PE5

### Nets
3V: C37.2 C40.2 C42.2 C43.2 C55.2 C68.2 U5.2(CS_XL) U5.3(CS_MAG) U5.9(VDD) U5.10(VDDIO) U7.1(VDD_IO) U7.15(RES) U7.16(VDD)
GND: B2.2 B2.3 C37.1 C39.1 C40.1 C41.1 C42.1 C43.1 C48.1 C55.1 C68.1 LD3.2 LD4.2 LD5.2 LD6.2 R35.1 R68.2 U5.6(GND) U5.8(GND) U7.8(RES) U7.9(RES) U7.10(RES) U7.11(RES) U7.12(RES) U7.13(GND)
VDD: B1.1 B1.4 R33.2 R37.2
NRST: SB1.1 ; port NRST
PA0: SB21.1 ; port PA0
PA5: U7.2(SCL/SPC) ; port PA5
PA6: U7.4(SDO/SA0) ; port PA6
PA7: U7.3(SDA/SDI/SDO) ; port PA7
PB6: U5.1(SCL) ; port PB6
PB9: U5.4(SDA) ; port PB9
PD12: R38.2 ; port PD12
PD13: R36.2 ; port PD13
PD14: R39.2 ; port PD14
PD15: R40.2 ; port PD15
PE0: U7.7(INT1) ; port PE0
PE1: U7.6(DRDY/INT2) ; port PE1
PE2: U5.7(DRDY) ; port PE2
PE3: U7.5(CS) ; port PE3
PE4: U5.12(INT1) ; port PE4
PE5: U5.11(INT2) ; port PE5
NetB1_2: B1.2 B1.3 C36.1 R34.2 R35.2
NetB2_1: B2.1 B2.4 C39.2 R33.1 SB1.2
NetC36_2: C36.2 R37.1
NetC41_2: C41.2 U5.5(C1)
NetC48_2: C48.2 C69.1 U7.14(PLLFILT)
NetC69_2: C69.2 R68.1
NetLD3_1: LD3.1 R36.1
NetLD4_1: LD4.1 R38.1
NetLD5_1: LD5.1 R39.1
NetLD6_1: LD6.1 R40.1
NetR34_1: R34.1 SB21.2

### Notes on the sheet
- (near U5) Accelerometer+Magnetometer LSM303AGR
- USER & WAKE-UP Button
- RESET Button
- I2C ADDw= 3Ch(Mag)
- I2C ADDw= 32h(Acc)
- U
- (near U7) 3-axis Gyroscope I3G4250D
- L
- R
- SPI1_MOSI
- SPI1_SCK
- SPI1_MISO
- CS_I2C/SPI
- D
- MEMS_INT1
- MEMS_INT2
- LEDs
- MEMS
- Title:
- Project:
- Size:
- Revision:
- Variant:
- A4
- -
- Date:
- Reference:
- Sheet:
- of

### Library data of the parts
B1 = SW-PUSH-CMS_BLUE: Non-Open Push-Button 0.1A 24V; Manuf_2: FARNELL; Manuf_Part_2: 535-930; Manuf_1: wealthmetal; Manuf_Part_1: TD0341X-G01-BLU; Ref St: 9180120; Footprint: BP1CMS; Distrib: *
B2 = SW-PUSH-CMS_BLACK: Non-Open Push-Button 0.1A 24V; Manuf_2: FARNELL; Manuf_Part_2: 535-930; Manuf_1: wealthmetal; Manuf_Part_1: TD0341X-G01-BLA; Ref St: 9180120; Footprint: BP1CMS; Distrib: *
C36 = Cap_NA_0402: Capacitor,NA,0402; Fitted: NO; Revision: July-2002: Re-released for DXP Platform.; Value: [NA]
C37 C43 = Cap_10uF_X5R_10%_0603: Capacitor,10uF,6.3V,X5R,20%,0603,YAGEO; Manuf_Part_1: CC0603KRX5R5BB106; Revision: July-2002: Re-released for DXP Platform.; Value: 10uF; Order: CC0603KRX5R5BB106; Manuf_1: YAGEO
C39 C40 C42 C55 C68 = Cap_100nF_X7R_10%_0402: as C2 on sheet ST_LINK_V2; Revision: July-2002: Re-released for DXP Platform.; Value: 100nF; Order: CC0402KRX7R7BB104; Manuf_1: YAGEO
C41 = Cap_220nF_X7R_10%_0603: Capacitor,220nF,16V,X7R,10%,0603,YAGEO; Manuf_Part_1: CC0603KRX7R7BB224; Revision: July-2002: Re-released for DXP Platform.; Value: 220nF; Order: CC0603KRX7R7BB224; Manuf_1: YAGEO
C48 = Cap_10nF_X7R_10%_0603: as C5 on sheet ST_LINK_V2; Revision: July-2002: Re-released for DXP Platform.; Value: 10nF; Order: CC0603KRX7R9BB103; Manuf_1: YAGEO
C69 = MCD-01006: Capacitor, MLCC, 470nF, 16V, X7R, 10%, 0603, T=0.8mm; Manufacturer_Part_Number: CC0603KRX7R7BB474; Manufacturer: YAGEO; BMS_Part_Number: 9142003; Provided_By: SUBCO; Internal_Part_Number: MCD-01006; Status: Released; Part_Type: Capacitor; Package: C0603; ComponentLink1Description: Datasheet; ComponentLink1URL: http://tunmcdsvn.tun.st.com/Component_Datasheet_Library/Trunk/Capacitors/Yageo_Multilayer_Capacitor_X7R_series_100pF_to_22uF/; ECCN_US: N/A; ECCN_EU: N/A
LD3 = LED_orange: LED, orange, 0603; Manuf_1: everlight; Manuf_Part_1: 19-217/S2C-AM2N2VY/3T; Order: 19-217/S2C-AM2N2VY/3T
LD4 = LED_green: LED, green, 0603; Manuf_1: everlight; Manuf_Part_1: 19-213SYGC/S530-E2/TR8; Order: 19-213SYGC/S530-E2/TR8
LD5 = LED_red: as LD2 on sheet ST_LINK_V2; Order: 19-213-R6C-AP1Q2B/3T
LD6 = LED_blue: LED, blue, 0603; Manuf_1: everlight; Manuf_Part_1: 19-217/BHC-ZL1M2RY/3T; Order: 19-217/BHC-ZL1M2RY/3T
R33 = Res_NA_0402: Resistor,[NA],0402; Fitted: NO; Value: [NA]
R34 R68 = res1: Resistor; Published: 8-Jun-2000; Revision: July-2002: Re-released for DXP Platform.; Publisher: Altium Limited
  R34: Value: 330
  R68: Value: 10K
R35 = res1: Resistor; Value: 10K; Published: 8-Jun-2000; Revision: July-2002: Re-released for DXP Platform.; Publisher: Altium Limited
R36 R39 = Res1: Resistor; Published: 8-Jun-2000; Revision: July-2002: Re-released for DXP Platform.; Publisher: Altium Limited; Value: 1K
R37 = res1: Resistor; Value: 330; Published: 8-Jun-2000; Revision: July-2002: Re-released for DXP Platform.; Publisher: Altium Limited
R38 R40 = Res1: Resistor; Value: 1K; Published: 8-Jun-2000; Revision: July-2002: Re-released for DXP Platform.; Publisher: Altium Limited
SB1 SB21 = Circuit Breaker: Solder: YES; Revision: July-2002: Re-released for DXP Platform.
U5 = MCD-00709: 3D accelerometer and 3D magnetometer; Part_Type: IC; Manufacturer: STMICROELECTRONICS; BMS_Part_Number: 9177057; ECCN_US: EAR99; ECCN_EU: NEC; Provided_By: SUBCO with ST control; Internal_Part_Number: MCD-00709; Value: LSM303AGR; Status: Checked; Manufacturer_Part_Number: LSM303AGR; ComponentLink1Description: Datasheet; ComponentLink1URL: http://tunmcdsvn.tun.st.com/Component_Datasheet_Library/Trunk/IC/STM_IC_magnetometer_LSM303AGR
U7 = MCD-01963: MEMS motion sensor: 3-axis digital output gyroscope LG4-16 4x4mm; Part_Type: IC; Manufacturer: STMICROELECTRONICS; Order_Code_RS: 166-1109; ECCN_US: EAR99; ECCN_EU: NEC; Provided_By: SUBCO with ST control; Internal_Part_Number: MCD-01963; Value: I3G4250D; Status: Checked; Manufacturer_Part_Number: I3G4250D; Alternate_Manufacturer_Part_Number: N/A; Alternate_Manufacturer: N/A; Package: LGA-16; ComponentLink1Description: Datasheet; ComponentLink1URL: http://tunmcdsvn.tun.st.com/Component_Datasheet_Library/Trunk/IC/STM_I3G4250D_MEMS_3_axis_gyroscope; Order_Code_Digikey: I3G4250D-ND; Order_Code_Farnell: 2532375

## Sheet USB_OTG_FS.SchDoc: USB_OTG_FS
size A4; DocumentNumber: 5; SheetNumber: 6; SheetTotal: 7
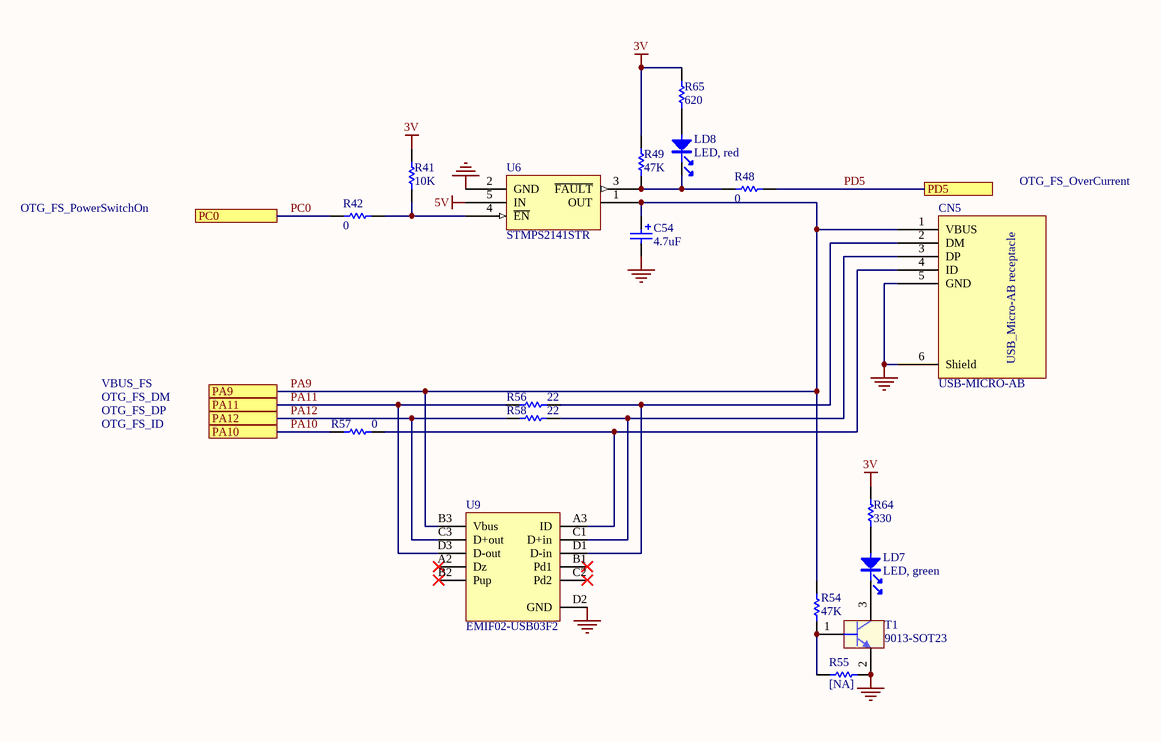
[diagram p5: USB_OTG_FS.SchDoc]

### Parts
C54  4.7uF  [TAN-A (Primary)]
CN5  USB-MICRO-AB  [USB-MICRO-AB (Primary)]
LD7  LED, green  [0603D (Primary)]
LD8  LED, red  [0603D (Primary)]
R41  10K  [0402R (Primary)]
R42  0  [0402R (Primary)]
R48  0  [0402R (Primary)]
R49  47K  [0402R (Primary)]
R54  47K  [0402R (Primary)]
R55  [NA]  [0402R (Primary)]
R56  22  [0402R (Primary)]
R57  0  [0402R (Primary)]
R58  22  [0402R (Primary)]
R64  330  [0603R (Primary)]
R65  620  [0603R (Primary)]
T1  9013-SOT23  [SOT23 (Primary)]
U6  STMPS2141STR  [SOT23-5L (Primary)]
U9  EMIF02-USB03F2  [Flip Chip (Primary)]

### Ports
PA9, PA10, PA11, PA12, PC0, PD5

### Nets
3V: R41.1 R49.1 R64.2 R65.2
5V: U6.5(IN)
GND: C54.2 CN5.5(GND) CN5.6(Shield) R55.2 T1.2(E) U6.2(GND) U9.D2(GND)
PA9: C54.1 CN5.1(VBUS) R54.2 U6.1(OUT) U9.B3(Vbus) ; port PA9
PA10: R57.1 ; port PA10
PA11: R56.2 U9.D3(D-out) ; port PA11
PA12: R58.2 U9.C3(D+out) ; port PA12
PC0: R42.1 ; port PC0
PD5: R48.2 ; port PD5
NetCN5_2: CN5.2(DM) R56.1 U9.D1(D-in)
NetCN5_3: CN5.3(DP) R58.1 U9.C1(D+in)
NetCN5_4: CN5.4(ID) R57.2 U9.A3(ID)
NetLD7_1: LD7.1 R64.1
NetLD7_2: LD7.2 T1.3(C)
NetLD8_1: LD8.1 R65.1
NetLD8_2: LD8.2 R48.1 R49.2 U6.3(~{FAULT})
NetR41_2: R41.2 R42.2 U6.4(~{EN})
NetR54_1: R54.1 R55.1 T1.1(B)

Not connected (* = marked no-connect by the designer): U9 A2(Dz)* B1(Pd1)* B2(Pup)* C2(Pd2)*

### Notes on the sheet
- OTG_FS_PowerSwitchOn
- OTG_FS_OverCurrent
- VBUS_FS
- OTG_FS_ID
- OTG_FS_DM
- OTG_FS_DP
- Title:
- Project:
- Size:
- Revision:
- Variant:
- A4
- -
- Date:
- Reference:
- Sheet:
- of
- (in symbol USB-MICRO-AB) USB_Micro-AB receptacle

### Library data of the parts
C54 = Cap_4.7uF_POL_10%_TANA: Polarized Capacitor,4.7uF,16V,10%,typeA,AVX; Manuf_Part_1: TAJA475K016R; Revision: July-2002: Re-released for DXP Platform.; Value: 4.7uF; Manuf_1: AVX; Order: TAJA475K016R
CN5 = USB-MICRO-AB: USB-MICRO-AB, 47590-0001, SMT, MOLEX; Ref St: xxxxxxx; Manuf_1: MOLEX; Manuf_Part_1: 47590-0001; ECCN_US/EU: *; Distrib: *
LD7 = LED_green: as LD4 on sheet IO Peripherals; Order: 19-213SYGC/S530-E2/TR8
LD8 = LED_red: as LD2 on sheet ST_LINK_V2; Order: 19-213-R6C-AP1Q2B/3T
R41 R49 R54 R64 = res1: Resistor; Value: 1K; Published: 8-Jun-2000; Revision: July-2002: Re-released for DXP Platform.; Publisher: Altium Limited
R42 R48 R57 = Res_0_0402: Resistor,0,0402; Value: 0
R55 = Res_NA_0402: Resistor,[NA],0402; Fitted: NO; Value: [NA]
R56 R58 R65 = Res1: Resistor; Value: 1K; Published: 8-Jun-2000; Revision: July-2002: Re-released for DXP Platform.; Publisher: Altium Limited
T1 = 9013-SOT23: NPN Bipolar Transistor; Manuf_1: unisonic; Manuf_Part_1: MMBT9013; Revision: July-2002: Re-released for DXP Platform.; Order: MMBT9013
U6 = STMPS2141STR: Enhanced single channel power switches; Manuf_1: STM; Provided: ST; ECCN_US/EU: EAR99/NEC; Ref St: 9159003; Order: STMPS2141STR; Manuf_Part_1: STMPS2141STR; Distrib: ST
U9 = EMIF02-USB03F2: 2-line IPAD, EMI filter including ESD protection; Manuf_1: STM; Provided: ST; ECCN_US/EU: EAR99/NEC; Ref St: 9179037; Order: EMIF02-USB03F2; Manuf_Part_1: EMIF02-USB03F2; Distrib: ST

## Nets that join several sheets
2V5: ST_LINK_V2 (C14.1 C15.2 U3.5), Audio (7 pins)
3V: MB1115_TOP (P2.5 P2.6), ST_LINK_V2 (17 pins), Audio (10 pins), IO Peripherals (13 pins), USB_OTG_FS (R41.1 R49.1 R64.2 R65.2)
5V: MB1115_TOP (P2.3 P2.4), ST_LINK_V2 (9 pins), USB_OTG_FS (U6.5)
GND: MB1115_TOP (10 pins), ST_LINK_V2 (42 pins), Audio (28 pins), IO Peripherals (25 pins), USB_OTG_FS (7 pins)
VDD: MB1115_TOP (P1.3 P1.4 P2.22), ST_LINK_V2 (JP2.2), IO Peripherals (B1.1 B1.4 R33.2 R37.2)
NRST: ST_LINK_V2 (SB13.2), IO Peripherals (SB1.1)
PB6: Audio (U8.2), IO Peripherals (U5.1)
PB9: Audio (U8.1), IO Peripherals (U5.4)

## Assembly variants
F411VE: not fitted C20 C28 C36 C67 JP1 R2 R11 R21 R22 R29 R33 R46 R47 R55 R62 R66 SB2 SB4 SB6 SB8 SB10 SB11 SB12 SB14 SB16 SB20 X3